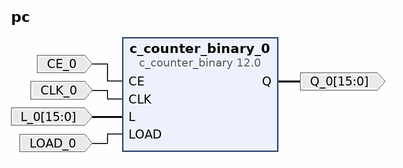
[diagram p0: block diagram of the top level]
# Vivado block design pc, xc7a100tcsg324-1, Vivado 2019.2
create_bd_design pc

create_bd_port -dir I -type ce CE_0
set_property -dict {CONFIG.POLARITY ACTIVE_HIGH} [get_bd_ports CE_0]
create_bd_port -dir I -type clk CLK_0
set_property -dict {CONFIG.FREQ_HZ 10000000} [get_bd_ports CLK_0]
create_bd_port -dir I -from 15 -to 0 -type data L_0
create_bd_port -dir I -type data LOAD_0
create_bd_port -dir O -from 15 -to 0 -type data Q_0

create_bd_cell -type ip -vlnv xilinx.com:ip:c_counter_binary:12.0 c_counter_binary_0
set_property -dict {CONFIG.CE true CONFIG.Load true CONFIG.SSET false} [get_bd_cells c_counter_binary_0]

# ---- connections ----

connect_bd_net -net CE_0_1 [get_bd_ports CE_0] [get_bd_pins c_counter_binary_0/CE]
connect_bd_net -net CLK_0_1 [get_bd_ports CLK_0] [get_bd_pins c_counter_binary_0/CLK]
connect_bd_net -net L_0_1 [get_bd_ports L_0] [get_bd_pins c_counter_binary_0/L]
connect_bd_net -net LOAD_0_1 [get_bd_ports LOAD_0] [get_bd_pins c_counter_binary_0/LOAD]
connect_bd_net [get_bd_pins c_counter_binary_0/Q] [get_bd_ports Q_0]

validate_bd_design
save_bd_design
